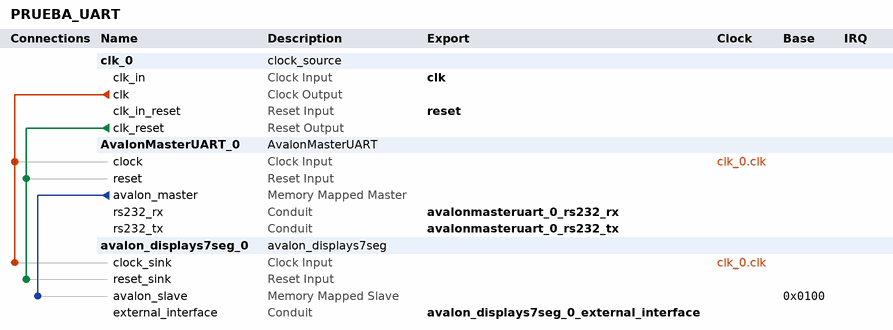
[diagram p0: system contents]
# Platform Designer (Qsys) system PRUEBA_UART, Cyclone IV E EP4CE115F29C7
# Parameters at their usual value, and those the tool derives, are not listed.
package require -exact qsys 17.1
create_system PRUEBA_UART
set_project_property DEVICE_FAMILY {Cyclone IV E}
set_project_property DEVICE EP4CE115F29C7

add_instance clk_0 clock_source 17.1
set_instance_parameter_value clk_0 clockFrequency 50000000

add_instance AvalonMasterUART_0 AvalonMasterUART 4.1
set_instance_parameter_value AvalonMasterUART_0 c_CLKS_PER_BIT 434

add_instance avalon_displays7seg_0 avalon_displays7seg 1.0
set_instance_parameter_value avalon_displays7seg_0 invert 0

# connections
add_connection clk_0.clk avalon_displays7seg_0.clock_sink clock
add_connection clk_0.clk AvalonMasterUART_0.clock clock
add_connection clk_0.clk_reset avalon_displays7seg_0.reset_sink reset
add_connection clk_0.clk_reset AvalonMasterUART_0.reset reset
add_connection AvalonMasterUART_0.avalon_master avalon_displays7seg_0.avalon_slave avalon
set_connection_parameter_value AvalonMasterUART_0.avalon_master/avalon_displays7seg_0.avalon_slave baseAddress 0x0100

# exported interfaces
add_interface avalon_displays7seg_0_external_interface conduit end
set_interface_property avalon_displays7seg_0_external_interface EXPORT_OF avalon_displays7seg_0.external_interface
add_interface avalonmasteruart_0_rs232_rx conduit end
set_interface_property avalonmasteruart_0_rs232_rx EXPORT_OF AvalonMasterUART_0.rs232_rx
add_interface avalonmasteruart_0_rs232_tx conduit end
set_interface_property avalonmasteruart_0_rs232_tx EXPORT_OF AvalonMasterUART_0.rs232_tx
add_interface clk clock sink
set_interface_property clk EXPORT_OF clk_0.clk_in
add_interface reset reset sink
set_interface_property reset EXPORT_OF clk_0.clk_in_reset

set_interconnect_requirement {$system} qsys_mm.clockCrossingAdapter HANDSHAKE
set_interconnect_requirement {$system} qsys_mm.enableEccProtection FALSE
set_interconnect_requirement {$system} qsys_mm.insertDefaultSlave FALSE
set_interconnect_requirement {$system} qsys_mm.maxAdditionalLatency 1

save_system PRUEBA_UART.qsys
